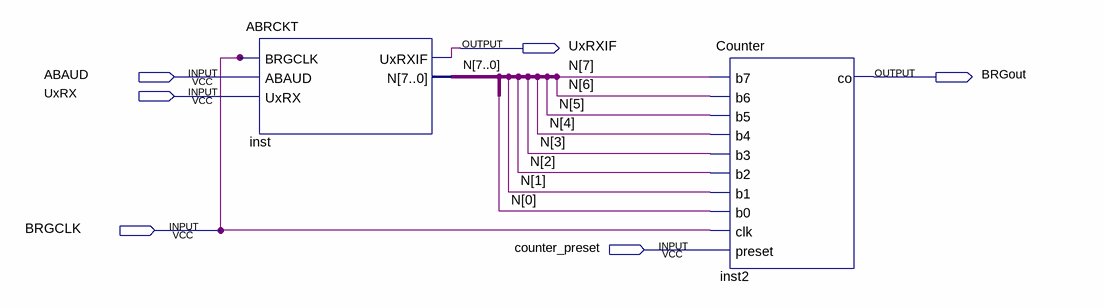
[diagram p0: schematic sheet]
// Quartus schematic BRGCKT.bdf as structural Verilog: 2 symbols, 6 pins
module BRGCKT (
  input  ABAUD,
  input  UxRX,
  input  BRGCLK,
  input  counter_preset,
  output UxRXIF,
  output BRGout
);

  wire [7:0] N;

  ABRCKT inst (.BRGCLK(BRGCLK), .ABAUD(ABAUD), .UxRX(UxRX), .UxRXIF(UxRXIF), .N(N));
  Counter inst2 (
    .b7(N[7]), .b6(N[6]), .b5(N[5]), .b4(N[4]), .b3(N[3]), .b2(N[2]), .b1(N[1]), .b0(N[0]), .clk(BRGCLK),
    .preset(counter_preset), .co(BRGout));
endmodule
